# EAGLE design untitled (EAGLE 7.3.0)
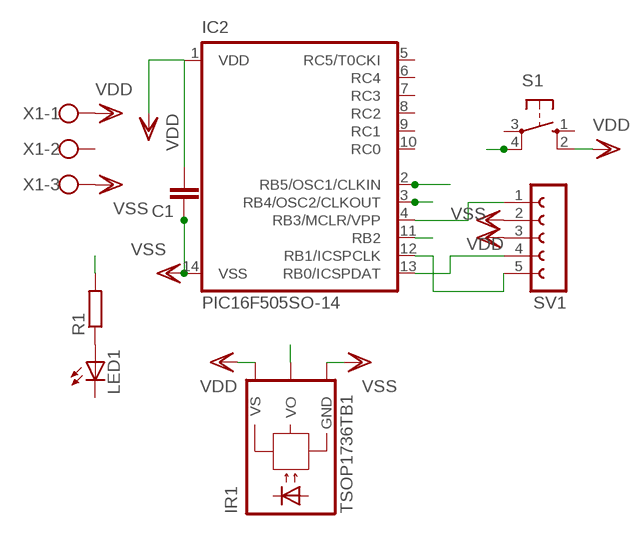
[diagram p0: schematic, sheet 1]

## Parts
C1  C-EUC0805  [C0805]
IC2  PIC16F505SO-14  [SO-14]
IR1  TSOP1736TB1  [TSOP17_TB1]
LED1  LEDCHIP-LED0603  [CHIP-LED0603]
R1  R-EU_R0805  [R0805]
S1  10-XX  [B3F-10XX]
SV1  FE05-1  [FE05-1]
X1  W237-103  [W237-103]

## Nets
N$1: IC2.4(RB3/MCLR/VPP) SV1.1
N$2: LED1.A R1.1
N$3: IC2.13(RB0/ICSPDAT) SV1.4
N$4: IC2.12(RB1/ICSPCLK) SV1.5
RB2: IC2.11(RB2) S1.4(P1)
RB4: IC2.3(RB4/OSC2/CLKOUT) R1.2
RB5: IC2.2(RB5/OSC1/CLKIN) IR1.VO
VDD: C1.2 IC2.1(VDD) IR1.VS S1.2(S1) SV1.2 X1.1
VSS: C1.1 IC2.14(VSS) IR1.GND SV1.3 X1.3
Unconnected: IC2.5(RC5/T0CKI) IC2.6(RC4) IC2.7(RC3) IC2.8(RC2) IC2.9(RC1) IC2.10(RC0) LED1.C S1.1(S) S1.3(P) X1.2

## Library data of the parts
C1 = rcl:C-EU: CAPACITOR, European symbol
IC2 = microchip-4:PIC16F505: MICROCONTROLLER 1k Program Flash memory 72 bytes SRAM 12 I/O One 8-bit timer (TMR0) Precision 4 MHz internal oscillator
IR1 = telefunken:TSOP17*TB1: TSOP17..TB1 IR Receiver Modules for Remote Control Systems Source: http://www.vishay.com/docs/82042/82042.pdf; OC_FARNELL: unknown; OC_NEWARK: unknown
LED1 = led:LED: LED OSRAM: - CHIPLED LG R971, LG N971, LY N971, LG Q971, LY Q971, LO R971, LY R971 LH N974, LH R974 LS Q976, LO Q976, LY Q976 LO Q996 - Hyper CHIPLED LW Q18S LB Q993, LB Q99A, LB R99A - SideLED LS A670, LO A670, LY A670, LG A670, LP A670 LB A673, LV A673, LT A673, LW A673 LH A674 LY A675 LS A676, LA A676, LO A676, LY A676, LW A676 LS A679, LY A679, LG A679 - Hyper Micro SIDELED® LS Y876, LA Y876, LO Y876, LY Y876 LT Y87S - SmartLED LW L88C, LW L88S LB L89C, LB L89S, LG L890 LS L89K, LO L89K, LY L89K LS L896, LA L896, LO L896, LY L896 - TOPLED LS T670, LO T670, LY T670, LG T670, LP T670 LSG T670, LSP T670, LSY T670, LOP T670, LYG T670 LG T671, LOG T671, LSG T671 LB T673, LV T673, LT T673, LW T673 LH T674 LS T676, LA T676, LO T676, LY T676, LB T676, LH T676, LSB T676, LW T676 LB T67C, LV T67C, LT T67C, LS T67K, LO T67K, LY T67K, LW E67C LS E67B, LA E67B, LO E67B, LY E67B, LB E67C, LV E67C, LT E67C LW T67C LS T679, LY T679, LG T679 LS T770, LO T770, LY T770, LG T770, LP T770 LB T773, LV T773, LT T773, LW T773 LH T774 LS E675, LA E675, LY E675, LS T675 LS T776, LA T776, LO T776, LY T776, LB T776 LHGB T686 LT T68C, LB T68C - Hyper Mini TOPLED® LB M676 - Mini TOPLED Santana® LG M470 LS M47K, LO M47K, LY M47K Source: http://www.osram.convergy.de LUXEON: - LUMILED® LXK2-PW12-R00, LXK2-PW12-S00, LXK2-PW14-U00, LXK2-PW14-V00 LXK2-PM12-R00, LXK2-PM12-S00, LXK2-PM14-U00 LXK2-PE12-Q00, LXK2-PE12-R00, LXK2-PE12-S00, LXK2-PE14-T00, LXK2-PE14-U00 LXK2-PB12-K00, LXK2-PB12-L00, LXK2-PB12-M00, LXK2-PB14-N00, LXK2-PB14-P00, LXK2-PB14-Q00 LXK2-PR12-L00, LXK2-PR12-M00, LXK2-PR14-Q00, LXK2-PR14-R00 LXK2-PD12-Q00, LXK2-PD12-R00, LXK2-PD12-S00 LXK2-PH12-R00, LXK2-PH12-S00 LXK2-PL12-P00, LXK2-PL12-Q00, LXK2-PL12-R00 Source: www.luxeon.com KINGBRIGHT: KA-3528ASYC Source: www.kingbright.com
R1 = rcl:R-EU_: RESISTOR, European symbol
S1 = switch-omron:10-XX: OMRON SWITCH; MPN: B3F-1000; OC_FARNELL: 176432; OC_NEWARK: 36M3542
SV1 = con-lsta:FE05-1: FEMALE HEADER; OC_FARNELL: unknown; OC_NEWARK: unknown
X1 = con-wago-500:W237-103: WAGO SCREW CLAMP; MPN: 237-103; OC_FARNELL: unknown; OC_NEWARK: 18M7116

## Board
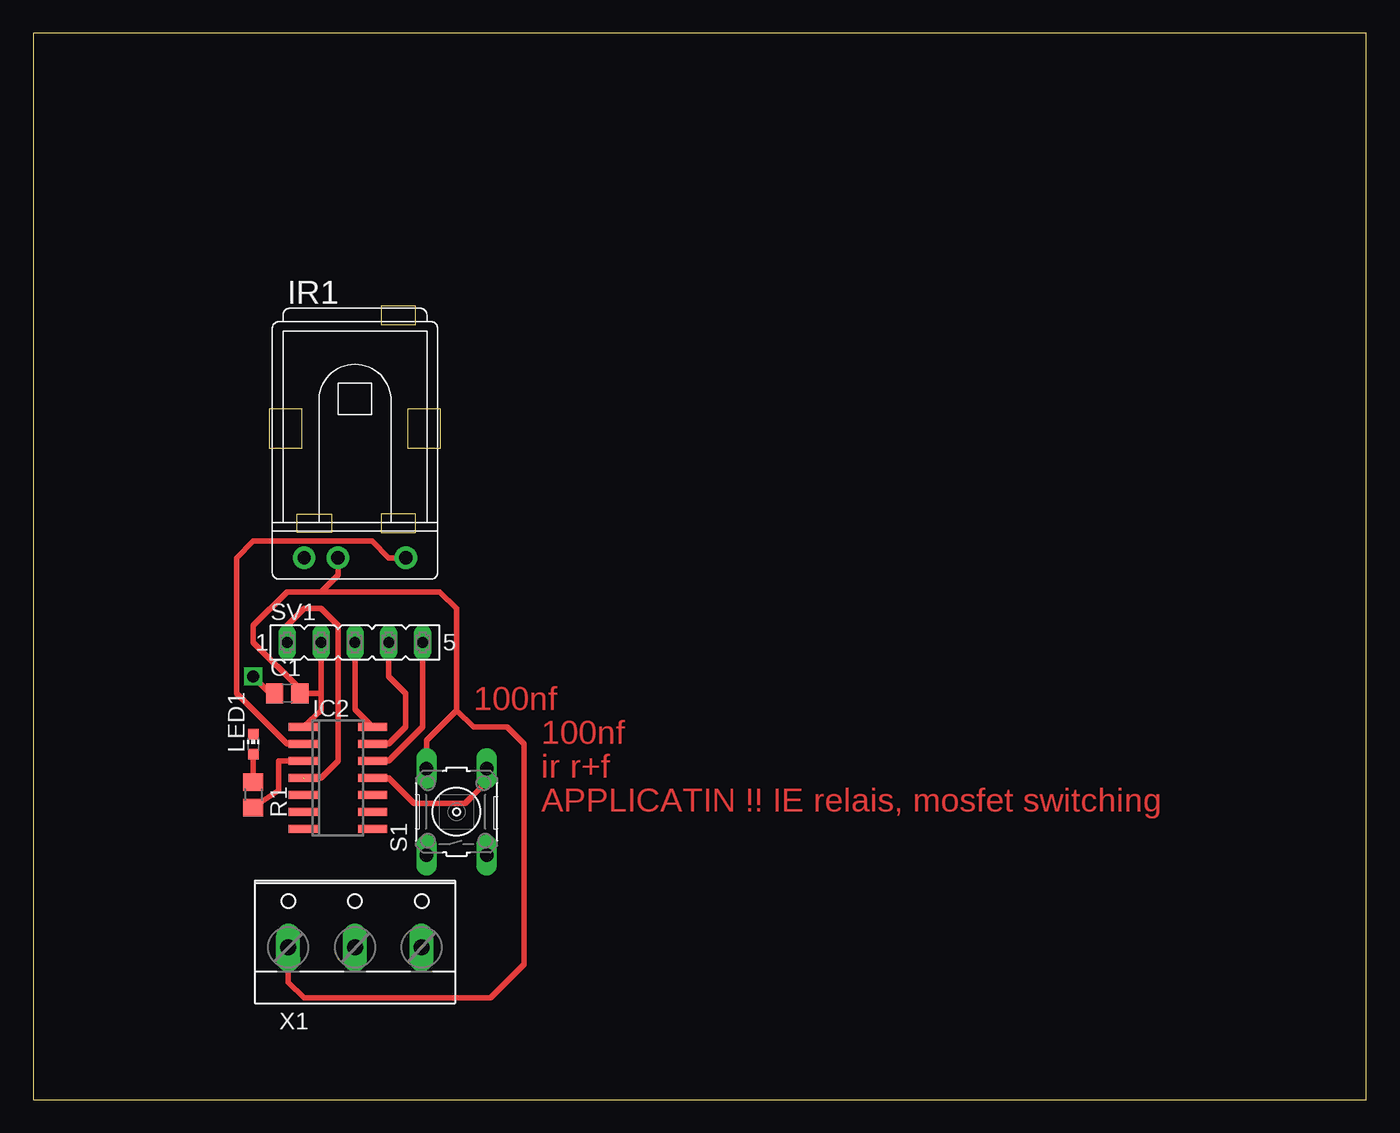
[diagram p1: board, top side]
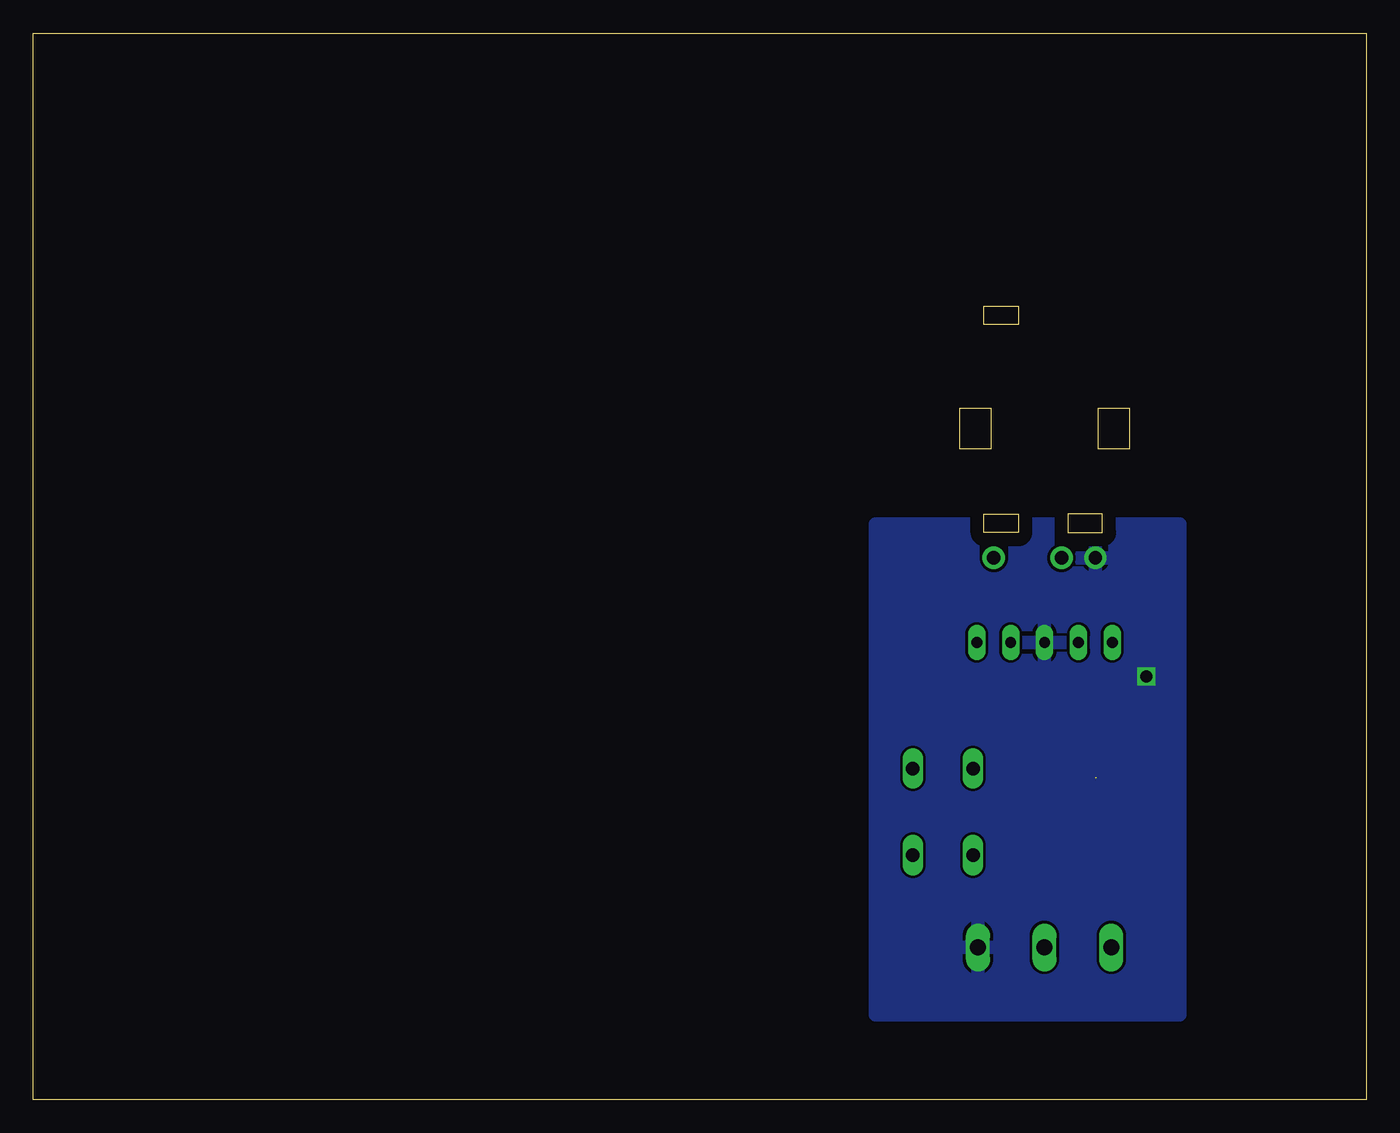
[diagram p2: board, bottom side, seen from below]

Size 100 x 80 mm. Coordinates in mm from the lower left corner, seen from the top.
Outline: 0,0 100,0 100,80 0,80 0,0
Copper layers (1*16): Top 0.035mm / dielectric 1.5mm / Bottom 0.035mm
Design rules "default": minimum track width 10mil, minimum drill 24mil, track to track 8mil, track to pad 8mil, pad to pad 8mil, via to via 8mil, smd to smd 8mil, copper to edge 40mil, drill to drill 8mil, minimum pad ring 10mil, minimum via ring 8mil, stop-mask expansion 4mil, vias tented up to drill 0mil, thermal gap 10mil

### Footprints (pad centres in the part's own frame; a part is rotated, then mirrored left to right if it is on the bottom)
C0805 = smd 1.3 x 1.5: 1 -0.95,0; 2 0.95,0
SO-14 = smd 0.6 x 2.2: 1 -3.81,-2.6; 2 -2.54,-2.6; 3 -1.27,-2.6; 4 0,-2.6; 5 1.27,-2.6; 6 2.54,-2.6; 7 3.81,-2.6; 8 3.81,2.6; 9 2.54,2.6; 10 1.27,2.6; 11 0,2.6; 12 -1.27,2.6; 13 -2.54,2.6; 14 -3.81,2.6
TSOP17_TB1 = drill 1 pad 1.676: GND 0,-3.81; VO 0,3.81; VS 0,-1.27
CHIP-LED0603 = smd 0.8 x 0.8: A 0,-0.75; C 0,0.75
R0805 = smd 1.3 x 1.5: 1 -0.95,0; 2 0.95,0
B3F-10XX = drill 1.016 long: 1 -3.251,2.261; 2 3.251,2.261; 3 -3.251,-2.261; 4 3.251,-2.261
FE05-1 = drill 0.813 long: 1 -5.08,0; 2 -2.54,0; 3 0,0; 4 2.54,0; 5 5.08,0
W237-103 = drill 1.194 long: 1 -5,-1.29; 2 0,-1.29; 3 5,-1.29

### Placement (x,y rotation side)
C1  19.05,30.48 0 top
IC2  22.86,24.13 270 top
IR1  24.13,40.64 270 top
LED1  16.51,26.67 0 top
R1  16.51,22.86 270 top
S1  31.75,21.59 90 top
SV1  24.13,34.29 0 top
X1  24.13,12.7 0 top

### Tracks (layer width: path | path; a pad name or v marks a point on that pad's centre or on a via)
N$1  (1 unrouted)
  Top 0.406: SV1.1 19.05,35.56 20.32,36.83 21.59,36.83 22.86,35.56 22.86,25.4 21.59,24.13 20.32,24.13
N$2
  Top 0.406: LED1.A R1.1
N$3
  Top 0.406: SV1.4 26.67,31.75 27.94,30.48 27.94,27.94 26.67,26.67 IC2.13
N$4
  Top 0.406: IC2.12 26.67,25.4 29.21,27.94 SV1.5
RB2
  Top 0.406: IC2.11 26.67,24.13 28.57,22.23 32.38,22.23 33.02,22.86 34.01,23.85 S1.4
RB4
  Top 0.406: IC2.3 18.41,25.4 18.41,23.18 R1.2
RB5
  Top 0.406: IR1.VO 26.67,40.64 25.4,41.91 16.51,41.91 15.24,40.64 15.24,30.48 19.05,26.67 IC2.2
VDD
  Top 0.406: IC2.1 21.59,29.21 21.59,30.48 | SV1.2 21.59,30.48 | 21.59,30.48 C1.2 20,30.8 16.51,34.29 16.51,35.56 19.05,38.1 21.59,38.1 | IR1.VS 22.86,39.37 21.59,38.1 | S1.2 29.49,26.95 31.75,29.21 | 31.75,29.21 31.75,36.83 30.48,38.1 21.59,38.1 | X1.1 19.13,8.81 20.32,7.62 34.29,7.62 36.83,10.16 36.83,26.67 35.56,27.94 33.02,27.94 31.75,29.21
VSS  (via drill 0.9 pad 0.81)
  Top 0.406: SV1.3 24.13,29.27 IC2.14 | C1.1 17.78,30.48 v16.51,31.75
  pour Bottom: 13.97,43.18 36.83,43.18 36.83,6.35 13.97,6.35

### Text on the board
Top: 100nf | 100nf | ir r+f | APPLICATIN !! IE relais, mosfet switching